# Altium project PCB_Project.PrjPcb
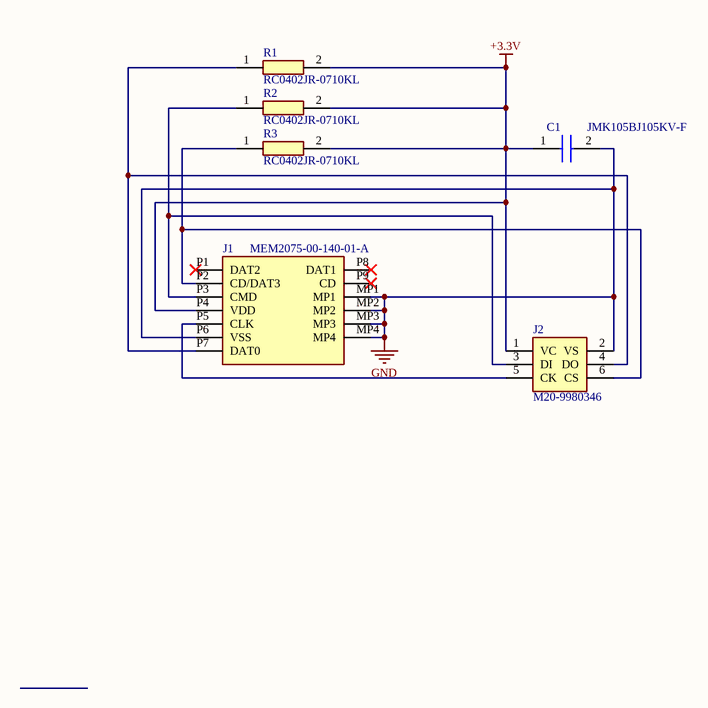
[diagram p0: SD_Card.SchDoc]
1 sheet, 6 parts. Net scope: global (net labels, ports and power ports of the same name join across sheets).
Board file: SD_Card.PcbDoc

## Sheet SD_Card.SchDoc
size A4

### Parts
C1  JMK105BJ105KV-F  [CAPC1005X55N]
J1  MEM2075-00-140-01-A  [MEM20750014001A]
J2  M20-9980346  [HDRV6W64P254_2X3_762X508X868P]
R1  RC0402JR-0710KL  [RESC1005X40N]
R2  RC0402JR-0710KL  [RESC1005X40N]
R3  RC0402JR-0710KL  [RESC1005X40N]

### Nets
+3.3V: C1.1 J1.P4(VDD) J2.1(VC) R1.2 R2.2 R3.2
GND: C1.2 J1.MP1 J1.MP2 J1.MP3 J1.MP4 J1.P6(VSS) J2.2(VS)
NetJ1_P2: J1.P2(CD/DAT3) J2.6(CS) R3.1
NetJ1_P3: J1.P3(CMD) J2.3(DI) R2.1
NetJ1_P5: J1.P5(CLK) J2.5(CK)
NetJ1_P7: J1.P7(DAT0) J2.4(DO) R1.1

Not connected (* = marked no-connect by the designer): J1 P1(DAT2)* P8(DAT1)* P9(CD)*

### Library data of the parts
C1 = JMK105BJ105KV-F: Capacitor; Manufacturer_Name: TAIYO YUDEN; Datasheet Link: https://datasheet.datasheetarchive.com/originals/distributors/Datasheets-DGA20/25674.pdf; Height: 0.55mm; Manufacturer_Part_Number: JMK105BJ105KV-F; Mouser Part Number: 963-JMK105BJ105KV-F; Mouser Price/Stock: https://www.mouser.co.uk/ProductDetail/Taiyo-Yuden/JMK105BJ105KV-F?qs=I6KAKw0tg2yJ6Hx%2Fbib9CA%3D%3D
J1 = MEM2075-00-140-01-A: Connector; Manufacturer_Name: GCT (GLOBAL CONNECTOR TECHNOLOGY); Datasheet Link: http://www.farnell.com/cad/2606866.pdf; Height: 1.45mm; Manufacturer_Part_Number: MEM2075-00-140-01-A; Mouser Part Number: 640-MEM20750014001A; Mouser Price/Stock: https://www.mouser.co.uk/ProductDetail/GCT/MEM2075-00-140-01-A?qs=KUoIvG%2F9IlZvfWpeERlq3Q%3D%3D
J2 = M20-9980346: Connector; Manufacturer_Name: Harwin; Datasheet Link: https://cdn.harwin.com/pdfs/M20-998.pdf?utm_source=3D_PDF&utm_medium=3D_PDF&utm_campaign=3D_PDF; Height: 8.68mm; Manufacturer_Part_Number: M20-9980346; Mouser Part Number: 855-M20-9980346; Mouser Price/Stock: https://www.mouser.co.uk/ProductDetail/Harwin/M20-9980346?qs=%252Bk6%2F5FB6qrmHk2P20oz3FA%3D%3D
R1-R3 = RC0402JR-0710KL: Resistor; Manufacturer_Name: KEMET; Datasheet Link: https://datasheet.datasheetarchive.com/originals/distributors/Datasheets_SAMA/902f9e387b938f871d31120f5fc1d65e.pdf; Height: 0.4mm; Manufacturer_Part_Number: RC0402JR-0710KL; Mouser Part Number: 603-RC0402JR-0710KL; Mouser Price/Stock: https://www.mouser.co.uk/ProductDetail/YAGEO/RC0402JR-0710KL?qs=V1yeUXFNrkk4BhFptVo0Rw%3D%3D